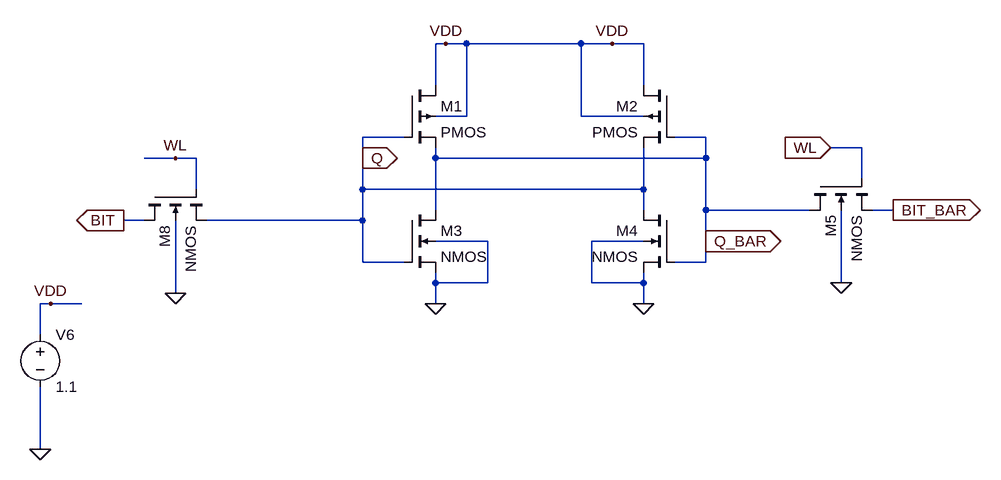
[diagram p0: schematic NEW_1CELL.asc]
NEW_1CELL.asc, the LTspice schematic file:
Version 4
SHEET 1 2972 2484
WIRE 176 112 160 112
WIRE 208 112 176 112
WIRE 384 112 208 112
WIRE 432 112 384 112
WIRE 480 112 432 112
WIRE 160 176 160 112
WIRE 480 176 480 112
WIRE 208 224 208 112
WIRE 208 224 160 224
WIRE 384 224 384 112
WIRE 480 224 384 224
WIRE 112 256 48 256
WIRE 576 256 528 256
WIRE 816 272 768 272
WIRE -240 288 -288 288
WIRE -208 288 -240 288
WIRE 48 288 48 256
WIRE 160 288 160 272
WIRE 576 288 576 256
WIRE 576 288 160 288
WIRE 816 320 816 272
WIRE -208 336 -208 288
WIRE 48 336 48 288
WIRE 480 336 480 272
WIRE 480 336 48 336
WIRE 160 368 160 288
WIRE 480 368 480 336
WIRE 576 368 576 288
WIRE 736 368 576 368
WIRE 864 368 832 368
WIRE -288 384 -320 384
WIRE 48 384 48 336
WIRE 48 384 -192 384
WIRE 240 416 160 416
WIRE 480 416 400 416
WIRE 576 416 576 368
WIRE 48 448 48 384
WIRE 112 448 48 448
WIRE 576 448 576 416
WIRE 576 448 528 448
WIRE 160 480 160 464
WIRE 240 480 240 416
WIRE 240 480 160 480
WIRE 400 480 400 416
WIRE 480 480 480 464
WIRE 480 480 400 480
WIRE 784 480 784 368
WIRE -240 496 -240 384
WIRE -432 512 -448 512
WIRE -384 512 -432 512
WIRE 160 512 160 480
WIRE 480 512 480 480
WIRE -448 560 -448 512
WIRE -448 736 -448 640
FLAG 160 512 0
FLAG 480 512 0
FLAG 784 480 0
FLAG -240 496 0
FLAG 768 272 WL
IOPIN 768 272 In
FLAG 432 112 VDD
FLAG 176 112 VDD
FLAG 576 416 Q_BAR
IOPIN 576 416 Out
FLAG 48 288 Q
IOPIN 48 288 Out
FLAG -240 288 WL
FLAG -448 736 0
FLAG -432 512 VDD
FLAG -320 384 BIT
IOPIN -320 384 Out
FLAG 864 368 BIT_BAR
IOPIN 864 368 Out
SYMBOL pmos4 112 176 R0
SYMATTR InstName M1
SYMATTR Value2 l=250n w=600n
SYMBOL pmos4 528 176 M0
SYMATTR InstName M2
SYMATTR Value2 l=250n w=600n
SYMBOL nmos4 112 368 R0
SYMATTR InstName M3
SYMATTR Value2 l=32n w=64n
SYMBOL nmos4 528 368 M0
SYMATTR InstName M4
SYMATTR Value2 l=32n w=64n
SYMBOL nmos4 736 320 M90
SYMATTR InstName M5
SYMATTR Value2 l=250n w=100n
SYMBOL nmos4 -288 336 M90
SYMATTR InstName M8
SYMATTR Value2 l=250n w=100n
SYMBOL voltage -448 544 R0
WINDOW 123 0 0 Left 0
WINDOW 39 0 0 Left 0
SYMATTR InstName V6
SYMATTR Value 1.1

The netlist it stands for:
* NEW_1CELL.asc
M1 VDD Q Q_BAR VDD PMOS l=250n w=600n
M2 VDD Q_BAR Q VDD PMOS l=250n w=600n
M3 Q_BAR Q 0 0 NMOS l=32n w=64n
M4 Q Q_BAR 0 0 NMOS l=32n w=64n
M5 Q_BAR WL BIT_BAR 0 NMOS l=250n w=100n
M8 BIT WL Q 0 NMOS l=250n w=100n
V6 VDD 0 1.1
.model NMOS NMOS
.model PMOS PMOS
.lib standard.mos
.backanno
.end